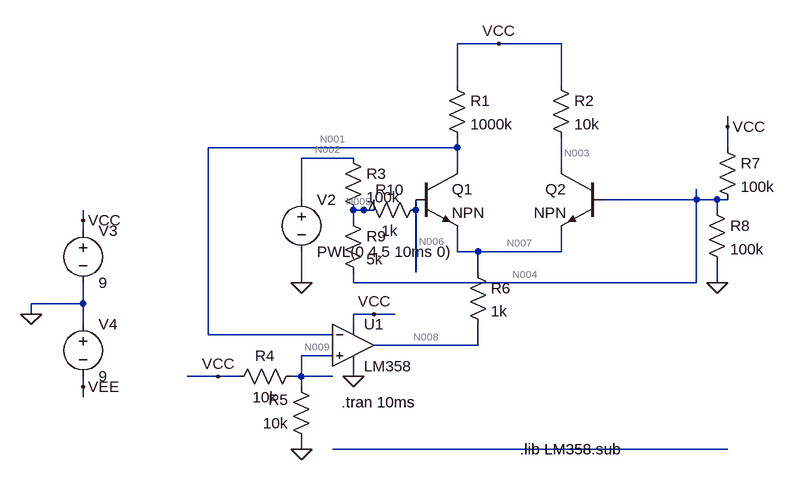
[diagram p0: schematic Draft1.asc]
Draft1.asc, the LTspice schematic file:
Version 4
SHEET 1 880 692
WIRE 32 48 -32 48
WIRE 128 48 32 48
WIRE -32 112 -32 48
WIRE 128 112 128 48
WIRE 384 176 384 160
WIRE -32 208 -32 192
WIRE -32 208 -416 208
WIRE 384 208 384 176
WIRE -192 224 -272 224
WIRE -32 240 -32 208
WIRE 128 240 128 192
WIRE -272 288 -272 224
WIRE 336 288 336 272
WIRE 336 288 192 288
WIRE 368 288 336 288
WIRE 384 288 368 288
WIRE -176 304 -192 304
WIRE -160 304 -160 288
WIRE -160 304 -176 304
WIRE -96 304 -96 288
WIRE 368 304 368 288
WIRE -608 320 -608 304
WIRE -192 320 -192 304
WIRE -608 336 -608 320
WIRE -32 368 -32 336
WIRE 0 368 -32 368
WIRE 128 368 128 336
WIRE 128 368 0 368
WIRE -96 400 -96 304
WIRE 0 400 0 368
WIRE -272 416 -272 368
WIRE -192 416 -192 400
WIRE 336 416 336 288
WIRE 336 416 -192 416
WIRE 368 416 368 384
WIRE -608 448 -608 416
WIRE -608 448 -688 448
WIRE -688 464 -688 448
WIRE -160 464 -192 464
WIRE -128 464 -160 464
WIRE -608 480 -608 448
WIRE -192 480 -192 464
WIRE -416 496 -416 208
WIRE -224 496 -416 496
WIRE 0 512 0 480
WIRE 0 512 -160 512
WIRE -224 528 -272 528
WIRE -400 560 -448 560
WIRE -368 560 -400 560
WIRE -272 560 -272 528
WIRE -272 560 -288 560
WIRE -224 560 -272 560
WIRE -192 560 -192 544
WIRE -608 576 -608 560
WIRE -272 576 -272 560
WIRE -608 592 -608 576
WIRE -272 672 -272 656
WIRE 384 672 -224 672
FLAG -272 416 0
FLAG -192 560 0
FLAG -272 672 0
FLAG -608 320 VCC
FLAG -608 576 VEE
FLAG -688 464 0
FLAG 32 48 VCC
FLAG -160 464 VCC
FLAG 368 416 0
FLAG 384 176 VCC
FLAG -400 560 VCC
SYMBOL npn -96 240 R0
SYMATTR InstName Q1
SYMBOL npn 192 240 M0
SYMATTR InstName Q2
SYMBOL res 112 96 R0
SYMATTR InstName R2
SYMATTR Value 10k
SYMBOL voltage -272 272 R0
WINDOW 123 0 0 Left 2
WINDOW 39 0 0 Left 2
SYMATTR InstName V2
SYMATTR Value PWL(0 4.5 10ms 0)
SYMBOL res -48 96 R0
SYMATTR InstName R1
SYMATTR Value 1000k
SYMBOL Opamps\\opamp2 -192 448 R0
SYMATTR InstName U1
SYMATTR Value LM358
SYMBOL res -272 544 R90
WINDOW 0 0 56 VBottom 2
WINDOW 3 32 56 VTop 2
SYMATTR InstName R4
SYMATTR Value 10k
SYMBOL res -256 672 R180
WINDOW 0 36 76 Left 2
WINDOW 3 36 40 Left 2
SYMATTR InstName R5
SYMATTR Value 10k
SYMBOL res -16 384 R0
SYMATTR InstName R6
SYMATTR Value 1k
SYMBOL voltage -608 320 R0
WINDOW 123 0 0 Left 2
WINDOW 39 0 0 Left 2
SYMATTR InstName V3
SYMATTR Value 9
SYMBOL voltage -608 464 R0
WINDOW 123 0 0 Left 2
WINDOW 39 0 0 Left 2
SYMATTR InstName V4
SYMATTR Value 9
SYMBOL res 368 192 R0
SYMATTR InstName R7
SYMATTR Value 100k
SYMBOL res 352 288 R0
SYMATTR InstName R8
SYMATTR Value 100k
SYMBOL res -208 208 R0
SYMATTR InstName R3
SYMATTR Value 100k
SYMBOL res -208 304 R0
SYMATTR InstName R9
SYMATTR Value 5k
SYMBOL res -80 288 R90
WINDOW 0 0 56 VBottom 2
WINDOW 3 32 56 VTop 2
SYMATTR InstName R10
SYMATTR Value 1k
TEXT -210 600 Left 2 !.tran 10ms
TEXT 64 672 Left 2 !.lib LM358.sub

The netlist it stands for:
* Draft1.asc
Q1 N001 N006 N007 0 NPN
Q2 N003 N004 N007 0 NPN
R2 VCC N003 10k
V2 N002 0 PWL(0 4.5 10ms 0)
R1 VCC N001 1000k
XU1 N009 N001 VCC 0 N008 LM358  ; pins In+ In- V+ V- OUT
R4 N009 VCC 10k
R5 0 N009 10k
R6 N007 N008 1k
V3 VCC 0 9
V4 0 VEE 9
R7 VCC N004 100k
R8 N004 0 100k
R3 N002 N005 100k
R9 N005 N004 5k
R10 N006 N005 1k
.model NPN NPN
.model PNP PNP
.lib standard.bjt
.tran 10ms
.lib LM358.sub
.backanno
.end

* Results of the author's LTspice run, read from the files saved beside the schematic
* Operating Point, zero values left out:
*   V(n001) = 4.5 V
*   V(n006) = 4.497 V
*   V(n007) = 3.862 V
*   V(n003) = 8.955 V
*   V(n004) = 4.497 V
*   V(vcc) = 9 V
*   V(n002) = 4.5 V
*   V(n008) = 3.853 V
*   V(n009) = 4.5 V
*   V(vee) = -9 V
*   V(n005) = 4.497 V
*   Ic(Q2) = 4.541 µA
*   Ib(Q2) = 45.4 nA
*   Ie(Q2) = -4.586 µA
*   Ic(Q1) = 4.52 µA
*   Ib(Q1) = 45.2 nA
*   Ie(Q1) = -4.565 µA
*   I(R10) = -45.2 nA
*   I(R9) = -14.52 nA
*   I(R3) = 30.68 nA
*   I(R8) = 44.97 µA
*   I(R7) = 45.03 µA
*   I(R6) = 9.151 µA
*   I(R5) = -450 µA
*   I(R4) = -450 µA
*   I(R1) = 4.5 µA
*   I(R2) = 4.541 µA
*   I(V3) = -811 µA
*   I(V2) = -30.68 nA
*   Ix(u1:1) = -19.93 nA
*   Ix(u1:2) = -19.94 nA
*   Ix(u1:3) = 307 µA
*   Ix(u1:4) = -306.9 µA
*   Ix(u1:5) = 9.151 µA
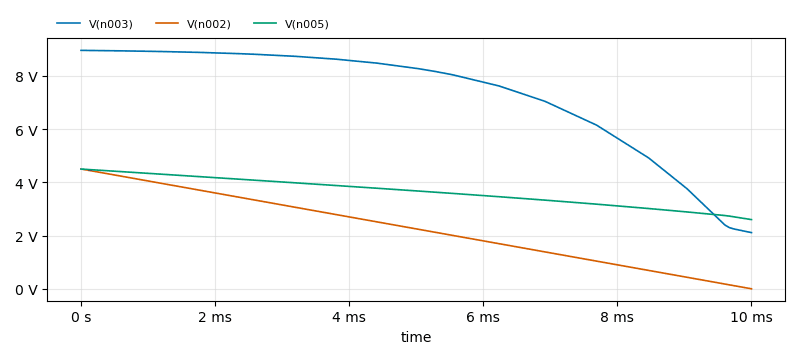
[diagram p1: Transient Analysis of Draft1.asc, plotted from the saved traces]
* Transient Analysis, 1 run:
*   V(n003): min 2.11 V, max 8.955 V, average 7.31 V, rms 7.582 V, last 2.11 V
*   V(n002): min 0 V, max 4.5 V, average 2.25 V, rms 2.6 V, last 0 V
*   V(n005): min 2.599 V, max 4.497 V, average 3.644 V, rms 3.681 V, last 2.599 V